# EAGLE design Adafruit MCP9808 STEMMA QT (EAGLE 9.6.2)
COMPANY: ADAFRUIT INDUSTRIES; DRAWN: KTOWN; REV: A
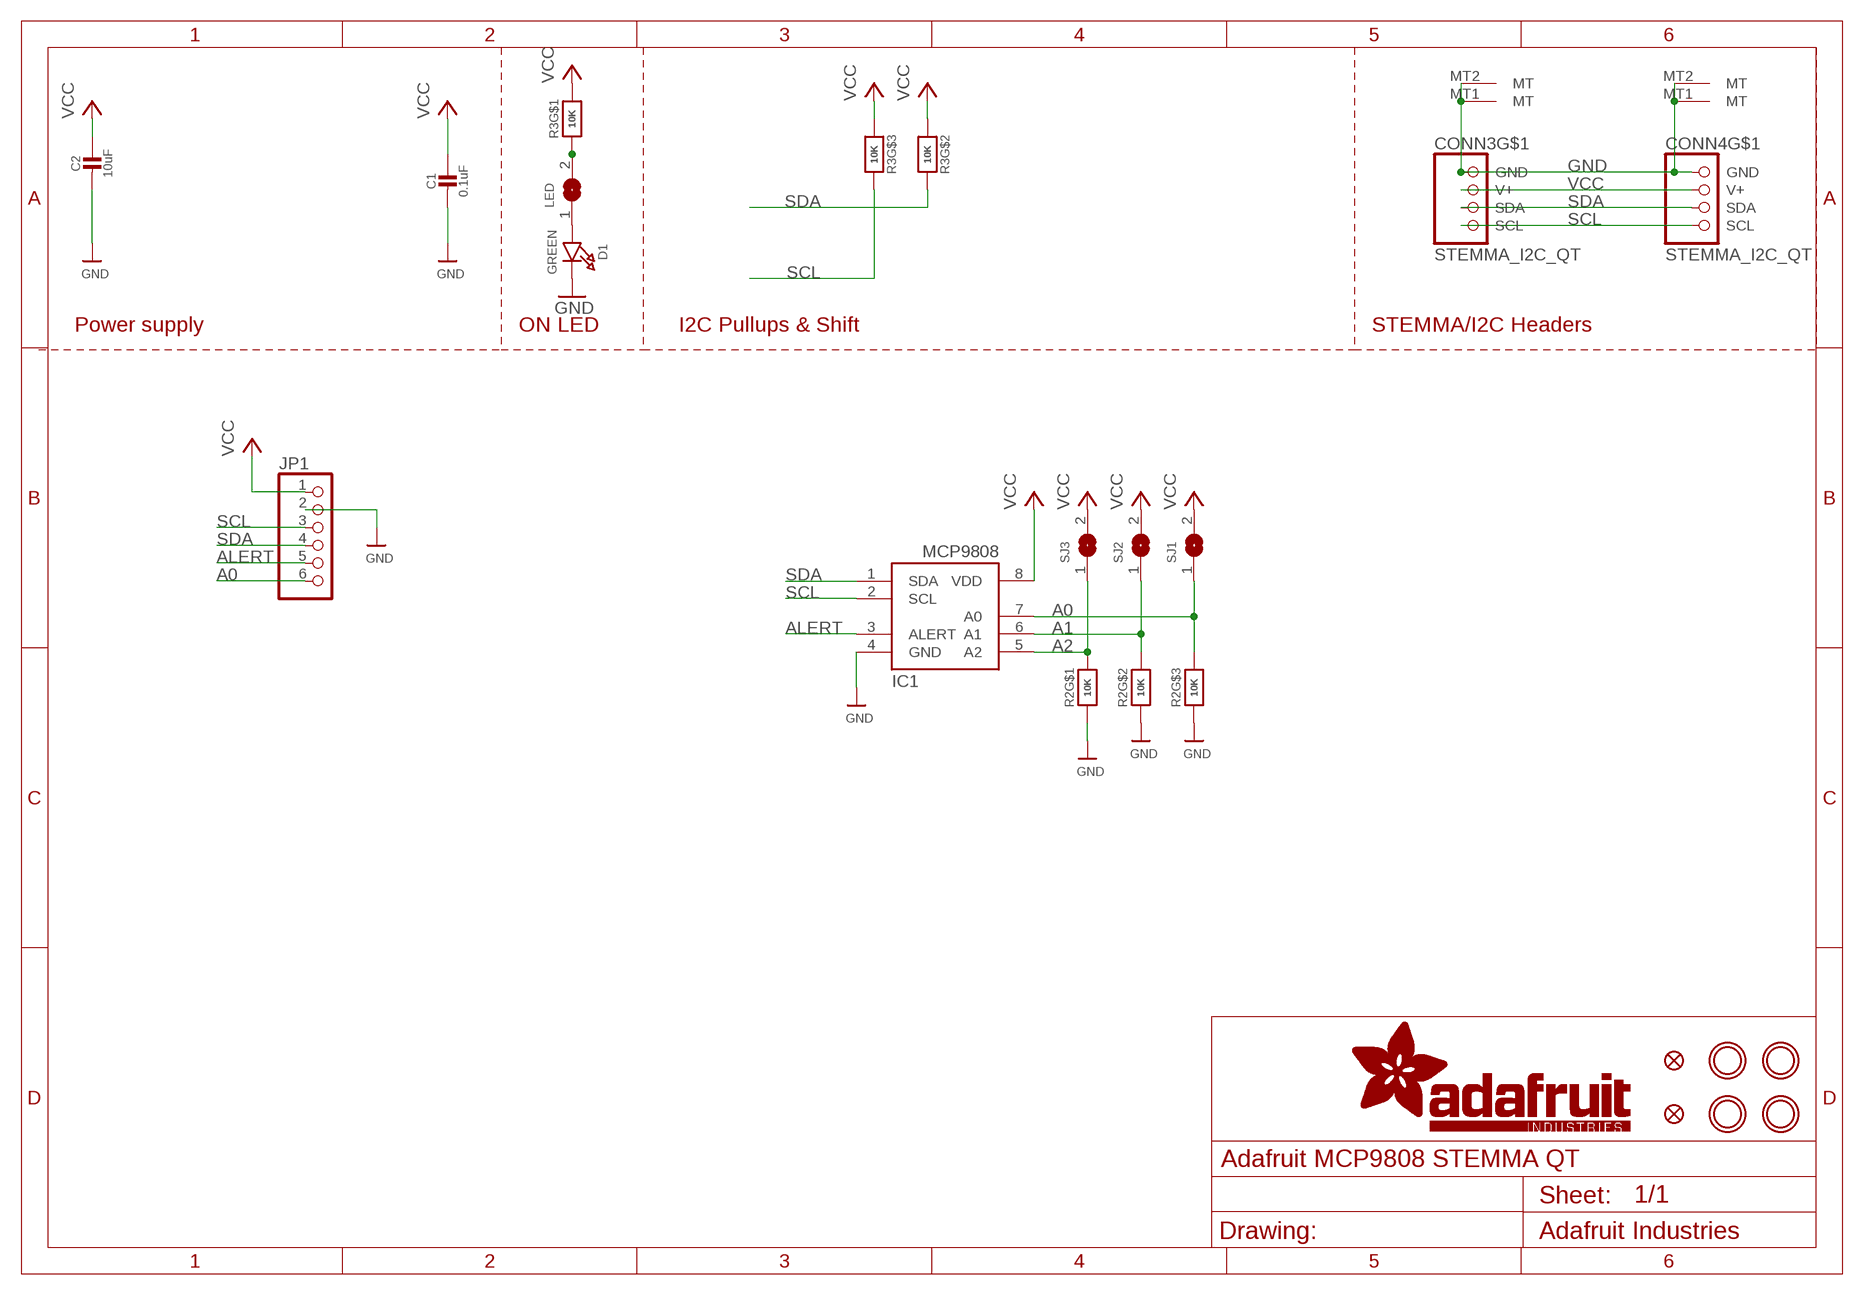
[diagram p0: schematic, sheet 1]

## Parts
C1  0.1uF  CAP_CERAMIC0603_NO  [0603-NO]
C2  10uF  CAP_CERAMIC0805-NOOUTLINE  [0805-NO]
CONN3  STEMMA_I2C_QT  [JST_SH4]
CONN4  STEMMA_I2C_QT  [JST_SH4]
D1  GREEN  LED0603_NOOUTLINE  [CHIPLED_0603_NOOUTLINE]
FID3  FIDUCIAL_1MM  [FIDUCIAL_1MM]
FID4  FIDUCIAL_1MM  [FIDUCIAL_1MM]
IC1  MCP9808-E/MS  [MSOP8_0.65MM]
JP1  HEADER-1X670MIL  [1X06_ROUND_70]
LED  SOLDERJUMPERCLOSED  [SOLDERJUMPER_CLOSEDWIRE]
R2  10K  RESISTOR_4PACK  [RESPACK_4X0603]
R3  10K  RESISTOR_4PACK  [RESPACK_4X0603]
SJ1  SOLDERJUMPER  [SOLDERJUMPER_ARROW_NOPASTE]
SJ2  SOLDERJUMPER  [SOLDERJUMPER_ARROW_NOPASTE]
SJ3  SOLDERJUMPER  [SOLDERJUMPER_ARROW_NOPASTE]
U$1  MOUNTINGHOLE2.5  [MOUNTINGHOLE_2.5_PLATED]
U$17  MOUNTINGHOLE2.5  [MOUNTINGHOLE_2.5_PLATED]
U$19  MOUNTINGHOLE2.5  [MOUNTINGHOLE_2.5_PLATED]
U$21  MOUNTINGHOLE2.5  [MOUNTINGHOLE_2.5_PLATED]

## Nets
A0: IC1.7(A0) JP1.6 R2.6 SJ1.1
A1: IC1.6(A1) R2.7 SJ2.1
A2: IC1.5(A2) R2.8 SJ3.1
ALERT: IC1.3(ALERT) JP1.5
GND [highpower]: C1.2 C2.2 CONN3.1(GND) CONN3.MT1(MT) CONN3.MT2(MT) CONN4.1(GND) CONN4.MT1(MT) CONN4.MT2(MT) D1.C IC1.4(GND) JP1.2 R2.1 R2.2 R2.3
N$1: LED.2 R3.1
N$2: D1.A LED.1
SCL: CONN3.4(SCL) CONN4.4(SCL) IC1.2(SCL) JP1.3 R3.6
SDA: CONN3.3(SDA) CONN4.3(SDA) IC1.1(SDA) JP1.4 R3.7
VCC [highpower]: C1.1 C2.1 CONN3.2(V+) CONN4.2(V+) IC1.8(VDD) JP1.1 R3.2 R3.3 R3.8 SJ1.2 SJ2.2 SJ3.2
Unconnected: R2.4 R2.5 R3.4 R3.5

## Notes on the sheet
- Power supply | ON LED | I2C Pullups & Shift | STEMMA/I2C Headers

## Library data of the parts
C1 C2 = microbuilder:CAP_CERAMIC: Ceramic Capacitors For new designs, use the packages preceded by an '_' character since they are more reliable: The following footprints should be used on most boards: _0402 - Standard footprint for regular board layouts _0603 - Standard footprint for regular board layouts _0805 - Standard footprint for regular board layouts _1206 - Standard footprint for regular board layouts For extremely tight-pitch boards where space is at a premium, the following 'micro-pitch' footprints can be used (smaller pads, no silkscreen outline, etc.): _0402MP - Micro-pitch footprint for very dense/compact boards _0603MP - Micro-pitch footprint for very dense/compact boards _0805MP - Micro-pitch footprint for very dense/compact boards _1206MP - Micro-pitch footprint for very dense/compact boards
CONN3 CONN4 = microbuilder:STEMMA_I2C
D1 = microbuilder:LED: LED 0603 - 0603 Surface Mount Package 2mA: Green LED - Low Power (3.9mcd, 2ma, 1.7Vf) - Digikey: 475-2709-2-ND Orange LED - Low Power (9.8mcd, 2ma, 1.8Vf) - Digikey: 475-1194-2-ND Red LED - Low Power (5mcd, 2ma, 1.8Vf) - Digikey: 475-1195-2-ND Yellow LED - Low Power (7mcd, 2ma, 1.8Vf) - Digikey: 475-1196-2-ND 5mA: Blue LED - Low Power (17mcd, 5ma, 2.9Vf) - Digikey: LNJ937W8CRACT-ND 0805 - 0805 Surface Mount Package 2mA: Red LED (8.8mcd, 2mA, 1.8Vf, Clear) - Low Power [Digikey: 475-2510-1-ND] Green LED (5mcd, 2mA, 1.8Vf, Clear) - Low Power [Digikey: 475-2730-1-ND] Yellow LED (11.3mcd, 2mA, 1.8Vf, Clear) - Low Power [Digikey: 475-2555-1-ND] 20mA: Red LED (104mcd, 20mA, Diffused) - LS R976 [Digikey: 475-1278-6-ND] Red LED (12mcd, 20mA, 2.0Vf, Clear) - APT2012EC [Digikey: 754-1128-1-ND] Green LED (15mcd, 20mA, 2.2Vf, Clear) - APT2012GC [Digikey: 754-1131-1-ND] Orange LED (160mcd, 20mA, 2.1Vf, Clear) - APT2012SECK [Digikey: 754-1130-1-ND] 1206 - 1206 Surface Mount Package Green LED (26mcd, 20mA, Diffused) - LG N971 [Digikey: 475-1407-6-ND] Red LED (15mcd, 20mA, Diffused) - LH N974 [Digikey: 475-1416-6-ND] Cree - Cree High-Power Surface Mount LEDs XPEBWT-L1-0000-00D50 - White 111lm 350mA 2.9Vf 6200K 110° XTEAWT-00-0000-00000LEE3 - White 114lm 350mA 2.85Vf 5000K 115° Everlight - Everlight 45-21 Series Surface Mount LEDs 45-21/QK2C-B2832AC2CB2/2T - Warm White 2000mcd 20mA 3.25Vf 3050K 120° 45-21/LK2C-B38452C4CB2/2T - Nuetral White 2000mcd 20mA 3.25Vf 4150K 120° 45-21/LK2C-B50634C6CB2/2T - Cold White 2200mcd 20mA 3.25Vf 5650K 120° PLCC2 Reverse Mount LS T77K-J1L2-1-0-2-R18-Z - Red 11.25mcd 2mA 1.8Vf 630nm 120° LO T77K-L1M2-24-Z - Orange 19.6mcd 2mA 1.8Vf 606nm 120° LY T77K-K2M1-26-Z - Yellow 15.7mcd 2mA 1.8Vf 587nm 120°
FID3 FID4 = microbuilder:FIDUCIAL: Fiducial Alignment Points Various fiducial points for machine vision alignment.; BOM: EXCLUDE
IC1 = microbuilder:MCP9808
JP1 = microbuilder:HEADER-1X6: PIN HEADER
LED = microbuilder:SOLDERJUMPER: SMD Solder JUMPER Solder the two pads together to create a connection, or remove the solder to break it. REFLOW - Use this footprint for solder paste and reflow ovens. WAVE - Use this footprint for hand-soldering (larger pads). CLOSED - Has a trace between the two pads to ensure it is closed by default. The trace needs to be cut to disable the jumper, and can be closed again by creating a solder bridge between the two pads.
R2 R3 = microbuilder:RESISTOR_4PACK: Resistor Packs (4 resistors) 4 x 0603 10K 1/16W - Digikey: YC164J-10KCT-ND
SJ1-SJ3 = microbuilder:SOLDERJUMPER: SMD Solder JUMPER Solder the two pads together to create a connection, or remove the solder to break it. REFLOW - Use this footprint for solder paste and reflow ovens. WAVE - Use this footprint for hand-soldering (larger pads). CLOSED - Has a trace between the two pads to ensure it is closed by default. The trace needs to be cut to disable the jumper, and can be closed again by creating a solder bridge between the two pads.; BOM: EXCLUDE
U$1 U$17 U$19 U$21 = microbuilder:MOUNTINGHOLE: Mounting Hole For #2 screws (0.086"/2.18mm width, 0.094"/2.4mm hole) use 2.5mm; BOM: EXCLUDE

## Net classes
1 highpower: width 0.305 mm, drill 0.483 mm
2 lowpower: width 0.254 mm, drill 0.483 mm

## Board
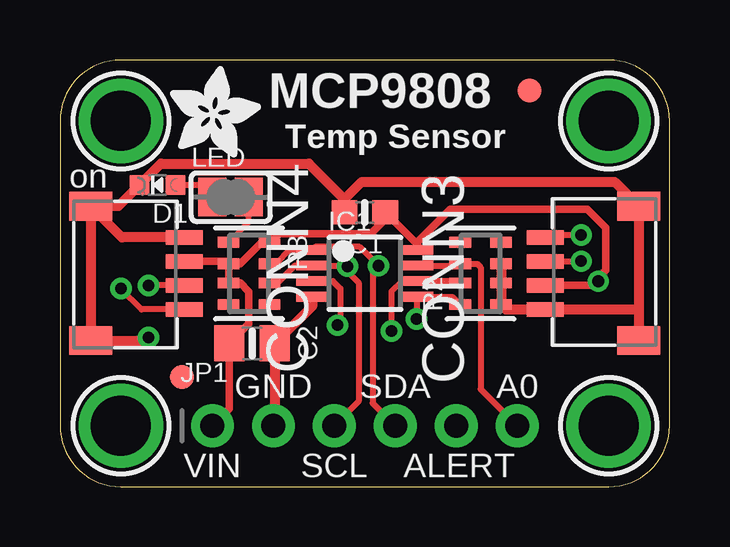
[diagram p1: board, top side]
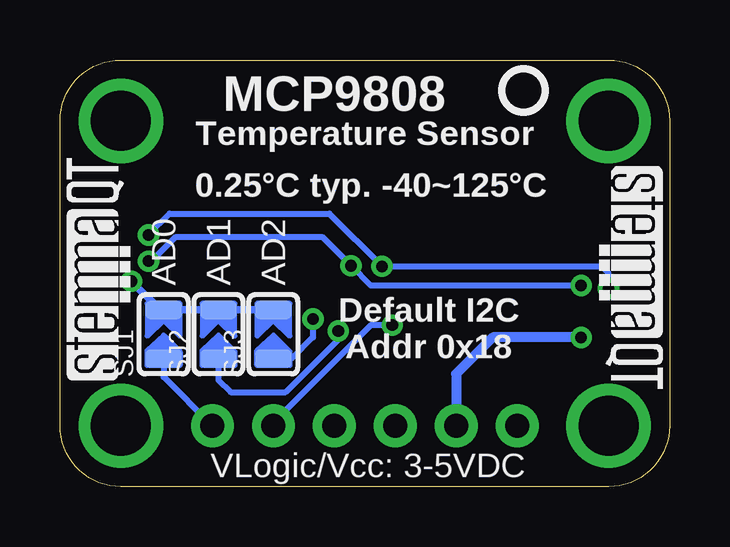
[diagram p2: board, bottom side, seen from below]

Size 25.4 x 17.78 mm. Coordinates in mm from the lower left corner, seen from the top.
Outline: 0,15.24 0,2.54 arc90 2.54,0 22.86,0 arc90 25.4,2.54 25.4,15.24 arc90 22.86,17.78 2.54,17.78 arc90 0,15.24
Copper layers (1*16): Top 0.035mm / dielectric 1.5mm / Bottom 0.035mm
Design rules "adafruit *": minimum track width 8mil, minimum drill 15.5mil, track to track 8mil, track to pad 8mil, pad to pad 8mil, via to via 8mil, smd to smd 8mil, copper to edge 10mil, drill to drill 8mil, minimum pad ring 10mil, minimum via ring 8mil, stop-mask expansion 2mil, vias tented up to drill 20mil, thermal gap 10mil

### Footprints (pad centres in the part's own frame; a part is rotated, then mirrored left to right if it is on the bottom)
0603-NO = smd 1.075 x 1: 1 -0.85,0; 2 0.85,0
0805-NO = smd 1.24 x 1.5: 1 -0.95,0; 2 0.95,0
JST_SH4 = smd 0.6 x 1.55: 1 -1.5,2.514; 2 -0.5,2.514; 3 0.5,2.514; 4 1.5,2.514 | smd 1.2 x 1.8: MT1 -2.8,-1.386; MT2 2.8,-1.386
CHIPLED_0603_NOOUTLINE = smd 0.8 x 0.8: A 0,-0.75; C 0,0.75
FIDUCIAL_1MM = smd 1 x 1: 1 0,0
MSOP8_0.65MM = smd 0.4 x 1.3: 1 -0.975,-2.2; 2 -0.325,-2.2; 3 0.325,-2.2; 4 0.975,-2.2; 5 0.975,2.2; 6 0.325,2.2; 7 -0.325,2.2; 8 -0.975,2.2
1X06_ROUND_70 = drill 1 pad 1.778: 1 -6.35,0; 2 -3.81,0; 3 -1.27,0; 4 1.27,0; 5 3.81,0; 6 6.35,0
SOLDERJUMPER_CLOSEDWIRE = smd 1.168 x 1.6: 1 -0.762,0; 2 0.762,0 | smd 0.635 x 0.203: WIRE 0,0
RESPACK_4X0603 = smd 0.45 x 0.9: 1 -1.3,-0.85; 2 -0.4,-0.85; 3 0.4,-0.85; 4 1.3,-0.85; 5 1.3,0.85; 6 0.4,0.85; 7 -0.4,0.85; 8 -1.3,0.85
SOLDERJUMPER_ARROW_NOPASTE = smd 0.762 x 1.524: 1 -1.016,0; 2 1.016,0
MOUNTINGHOLE_2.5_PLATED = drill 2.5 pad 3.2: P$1 0,0

### Placement (x,y rotation side)
C1  12.7,11.43 180 top
C2  8,5.97 0 top
CONN3  22.73,8.89 90 top
CONN4  2.67,8.89 270 top
D1  4.06,12.57 90 top
FID3  5.08,4.57 0 top
FID4  19.56,16.51 0 top
IC1  12.7,8.89 270 top
JP1  12.7,2.54 0 top
LED  7.11,12.06 0 top
R2  17.53,8.89 90 top
R3  7.87,8.89 270 top
SJ1  21.08,6.35 90 bottom
SJ2  18.8,6.35 90 bottom
SJ3  16.51,6.35 90 bottom
U$1  2.54,15.24 0 top
U$17  22.86,15.24 0 top
U$19  2.54,2.54 0 top
U$21  22.86,2.54 0 top
U$22  [ADAFRUIT_3.5MM]  4.57,13.72 0 top
U$25  [PCBFEAT-REV-040]  6.1,16.51 0 bottom
U$30  [STEMMAQT]  22.48,4.45 90 bottom
U$31  [STEMMAQT]  2.92,13.34 270 bottom

### Tracks (layer width: path | path; a pad name or v marks a point on that pad's centre or on a via)
A0
  Top 0.254: IC1.7 16.6,9.21 R2.6 17.38,9.29 17.53,9.14 17.53,4.06 JP1.6
  Bottom 0.254: SJ1.1 21.08,4.57 JP1.6
A1  (via drill 0.48)
  Top 0.254: R2.7 16.6,8.56 IC1.6 14.23,8.56 13.81,8.14 v13.81,6.49
  Bottom 0.254: SJ2.1 18.8,4.45 18.29,3.94 16,3.94 13.81,6.13 v13.81,6.49
A2  (via drill 0.48)
  Top 0.254: R2.8 16.35,7.92 IC1.5 14.86,7.87 v14.86,6.99
  Bottom 0.254: v14.86,6.99 14.86,6.22 15.75,5.33 SJ3.1
ALERT  (via drill 0.48)
  Top 0.254: IC1.3 11.37,8.56 11.68,8.26 11.68,6.86 v11.56,6.73
  Bottom 0.254: v11.56,6.73 12.45,6.73 16.57,2.6 JP1.5
GND  (via drill 0.48)
  Top 0.406: JP1.2 8.95,2.6 C2.2 10.5,7.52 IC1.4 | CONN4.MT1 CONN4.MT2 3.55,6.09 v3.68,6.22 | CONN4.MT1 2.43,11.69 D1.C 4.2,13.46 10.37,13.46 11.85,11.98 | CONN4.1 2.58,10.39 CONN4.MT1 | C1.2 11.85,11.98 | 11.85,11.98 12.57,12.7 23.11,12.7 CONN3.MT2 24.12,7.37 | 24.12,7.37 CONN3.MT1 | R2.3 R2.2 R2.1 18.58,7.39 CONN3.1 24.09,7.39 24.12,7.37
  Bottom 0.406: v3.68,6.22 7.37,6.22 8.89,4.7 JP1.2
N$1
  Top 0.254: R3.1 7.87,11.04 LED.2
N$2
  Top 0.254: D1.A 5.84,12.57 LED.1
SCL  (via drill 0.48)
  Top 0.254: R3.6 9.07,8.49 9.79,9.21 IC1.2 11.87,9.21 11.9,9.18 v11.98,9.18 11.98,8.98 12.45,8.51 12.45,3.56 JP1.3 | CONN3.4 20.32,10.49 v21.72,10.49 | CONN4.4 3.4,7.39 v2.54,8.26
  Bottom 0.254: v21.72,10.49 20.83,11.38 14.17,11.38 v11.98,9.18 11.95,9.16 2.81,9.16 2.54,8.89 v2.54,8.26
SDA  (via drill 0.48)
  Top 0.254: R3.7 9,9.29 9.58,9.87 IC1.1 10.63,9.99 12.49,9.99 v13.27,9.21 13.03,8.97 13.03,3.48 JP1.4 | CONN3.3 21.71,9.39 v21.72,9.4 | CONN4.3 3.69,8.39 v3.68,8.38
  Bottom 0.254: v21.72,9.4 21.59,9.4 20.57,10.41 14.48,10.41 v13.27,9.21 12.45,8.38 v3.68,8.38
VCC  (via drill 0.48)
  Top 0.305: CONN4.2 6.92,9.39 R3.2 | R3.2 R3.3 7.51,8.49 7.87,8.13 7.87,6.79 C2.1 7.05,3.24 JP1.1 | R3.2 7.51,9.29 8.41,10.19 R3.8 9.07,10.54 12.95,10.54 13.7,11.28 | C1.1 13.7,11.28 | 13.7,11.28 14.84,10.14 | 14.84,10.14 14.9,10.08 IC1.8 | CONN3.2 22.11,8.39 22.42,8.7 | 22.42,8.7 22.73,9.02 22.73,10.79 21.97,11.56 16.26,11.56 14.84,10.14 | v22.43,8.56 22.42,8.57 22.42,8.7
  Bottom 0.305: SJ3.2 SJ2.2 SJ1.2 21.23,7.37 v22.43,8.56

### Text on the board
tPlace: MCP9808 | Temp Sensor | on | GND | SDA | A0 | VIN | SCL | ALERT
bPlace: MCP9808 | Temperature Sensor | 0.25°C typ. -40~125°C | AD2 | AD1 | AD0 | Default I2C / Addr 0x18 | VLogic/Vcc: 3-5VDC